# EAGLE schematic Coursework_Rx (EAGLE 9.6.2)
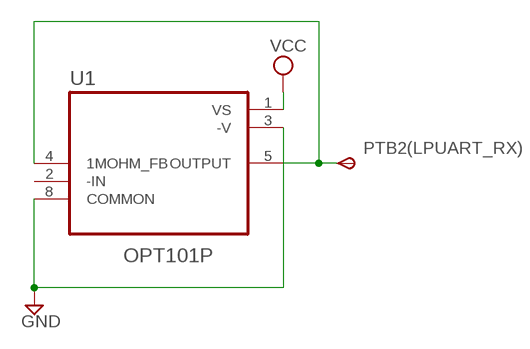
[diagram p0: schematic, sheet 1]

## Parts
PTB2(LPUART_RX)  TPSB2,54  [B2,54]
U1  OPT101P  [DIP762W46P254L952H419Q8]

## Nets
GND: U1.3(-V) U1.8(COMMON)
N$1: PTB2(LPUART_RX).TP(PP) U1.4(1MOHM_FB) U1.5(OUTPUT)
VCC: U1.1(VS)
Unconnected: U1.2(-IN)

## Library data of the parts
PTB2(LPUART_RX) = testpad:TPS: TEST PIN
U1 = OPT101P:OPT101P: Check prices <https://pricing.snapeda.com/parts/OPT101P/Texas%20Instruments/view-part?ref=eda>; AVAILABILITY: Warning; DESCRIPTION: Monolithic Photodiode and Single-Supply Transimpedance Amplifier 8-PDIP 0 to 70; MF: Texas Instruments; MP: OPT101P; PACKAGE: PDIP-8 Texas Instruments; PRICE: None; PURCHASE-URL: https://pricing.snapeda.com/search/part/OPT101P/?ref=eda